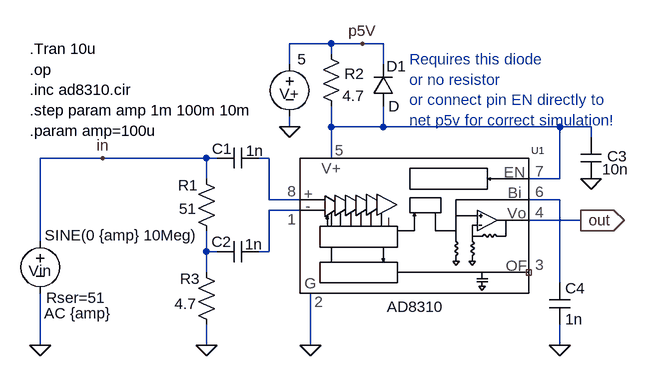
[diagram p0: schematic ad8310.asc]
ad8310.asc, the LTspice schematic file:
Version 4
SHEET 1 960 680
WIRE 16 -32 -48 -32
WIRE 64 -32 16 -32
WIRE 96 -32 64 -32
WIRE 16 -16 16 -32
WIRE -48 0 -48 -32
WIRE 96 0 96 -32
WIRE -48 96 -48 80
WIRE 16 96 16 64
WIRE 96 96 96 64
WIRE 96 96 16 96
WIRE 368 96 96 96
WIRE 416 96 368 96
WIRE 416 112 416 96
WIRE -336 144 -432 144
WIRE -176 144 -336 144
WIRE -160 144 -176 144
WIRE -80 144 -96 144
WIRE 16 144 16 96
WIRE -176 176 -176 144
WIRE 368 176 368 96
WIRE 368 176 320 176
WIRE -80 208 -80 144
WIRE -32 208 -80 208
WIRE 368 208 320 208
WIRE -32 224 -80 224
WIRE 400 240 320 240
WIRE -432 272 -432 144
WIRE -176 288 -176 256
WIRE -160 288 -176 288
WIRE -80 288 -80 224
WIRE -80 288 -96 288
WIRE -176 320 -176 288
WIRE 368 336 368 208
WIRE -432 432 -432 352
WIRE -176 432 -176 400
WIRE -16 432 -16 352
WIRE 368 432 368 400
FLAG -16 432 0
FLAG -176 432 0
FLAG -48 96 0
FLAG -432 432 0
FLAG -336 144 in
FLAG 400 240 out
IOPIN 400 240 Out
FLAG 64 -32 p5V
FLAG 416 176 0
FLAG 368 432 0
SYMBOL res -192 160 R0
WINDOW 0 -28 26 Left 0
WINDOW 3 -26 62 Left 0
SYMATTR InstName R1
SYMATTR Value 51
SYMATTR SpiceLine tol=5 pwr=0.5
SYMBOL cap -96 128 R90
WINDOW 0 17 56 VBottom 0
WINDOW 3 -11 6 VTop 0
SYMATTR InstName C1
SYMATTR Value 1n
SYMATTR SpiceLine V=10 Irms=10.541 Rser=0.004 MTBF=0 Lser=0 mfg="KEMET" pn="C0603C105K8PAC" type="X5R" ppPkg=1
SYMBOL cap -96 272 R90
WINDOW 0 16 57 VBottom 0
WINDOW 3 -11 7 VTop 0
SYMATTR InstName C2
SYMATTR Value 1n
SYMATTR SpiceLine V=10 Irms=10.541 Rser=0.004 MTBF=0 Lser=0 mfg="KEMET" pn="C0603C105K8PAC" type="X5R" ppPkg=1
SYMBOL voltage -48 -16 R0
WINDOW 123 0 0 Left 0
WINDOW 39 0 0 Left 0
WINDOW 0 -16 61 Left 0
WINDOW 3 12 8 Left 0
SYMATTR InstName V+
SYMATTR Value 5
SYMBOL voltage -432 256 R0
WINDOW 123 6 127 Left 0
WINDOW 39 9 103 Left 0
WINDOW 0 -18 61 Left 0
WINDOW 3 7 7 Left 0
SYMATTR Value2 AC {amp}
SYMATTR SpiceLine Rser=51
SYMATTR InstName Vin
SYMATTR Value SINE(0 {amp} 10Meg)
SYMBOL cap 400 112 R0
WINDOW 0 41 29 Left 0
WINDOW 3 33 49 Left 0
SYMATTR InstName C3
SYMATTR Value 10n
SYMATTR SpiceLine V=10 Irms=10.541 Rser=0.004 MTBF=0 Lser=0 mfg="KEMET" pn="C0603C105K8PAC" type="X5R" ppPkg=1
SYMBOL res -192 304 R0
WINDOW 0 -25 26 Left 0
WINDOW 3 -33 64 Left 0
SYMATTR InstName R3
SYMATTR Value 4.7
SYMATTR SpiceLine tol=5 pwr=0.25
SYMBOL AD8310 32 176 R0
SYMATTR InstName U1
SYMBOL cap 352 336 R0
SYMATTR InstName C4
SYMATTR Value 1n
SYMBOL res 0 -32 R0
WINDOW 0 36 46 Left 0
WINDOW 3 33 80 Left 0
SYMATTR InstName R2
SYMATTR Value 4.7
SYMBOL diode 80 64 M180
WINDOW 0 21 61 Left 0
WINDOW 3 24 0 Left 0
SYMATTR InstName D1
TEXT -448 8 Left 0 !.op\n.inc ad8310.cir\n.step param amp 1m 100m 10m\n.param amp=100u
TEXT -448 -24 Left 0 !.Tran 10u
TEXT 136 -8 Left 0 ;Requires this diode \nor no resistor \nor connect pin EN directly to\nnet p5v for correct simulation!

The netlist it stands for:
* ad8310.asc
R1 in N005 51 tol=5 pwr=0.5
C1 N002 in 1n V=10 Irms=10.541 Rser=0.004 MTBF=0 Lser=0 mfg="KEMET" pn="C0603C105K8PAC" type="X5R" ppPkg=1
C2 N004 N005 1n V=10 Irms=10.541 Rser=0.004 MTBF=0 Lser=0 mfg="KEMET" pn="C0603C105K8PAC" type="X5R" ppPkg=1
V+ p5V 0 5
Vin in 0 SINE(0 {amp} 10Meg) AC {amp} Rser=51
C3 N001 0 10n V=10 Irms=10.541 Rser=0.004 MTBF=0 Lser=0 mfg="KEMET" pn="C0603C105K8PAC" type="X5R" ppPkg=1
R3 N005 0 4.7 tol=5 pwr=0.25
XU1 N001 N002 N004 0 N001 N003 out NC_01 AD8310  ; pins V+ VI+ VI- GND ENAB BUFIN VOUT OFFSFILT
C4 N003 0 1n
R2 p5V N001 4.7
D1 N001 p5V D
.model D D
.lib standard.dio
.op
.inc ad8310.cir
.step param amp 1m 100m 10m
.param amp=100u
.Tran 10u
* Requires this diode
* or no resistor
* or connect pin EN directly to
* net p5v for correct simulation!
.backanno
.end